# EAGLE design DotPhat (EAGLE 7.7.0)
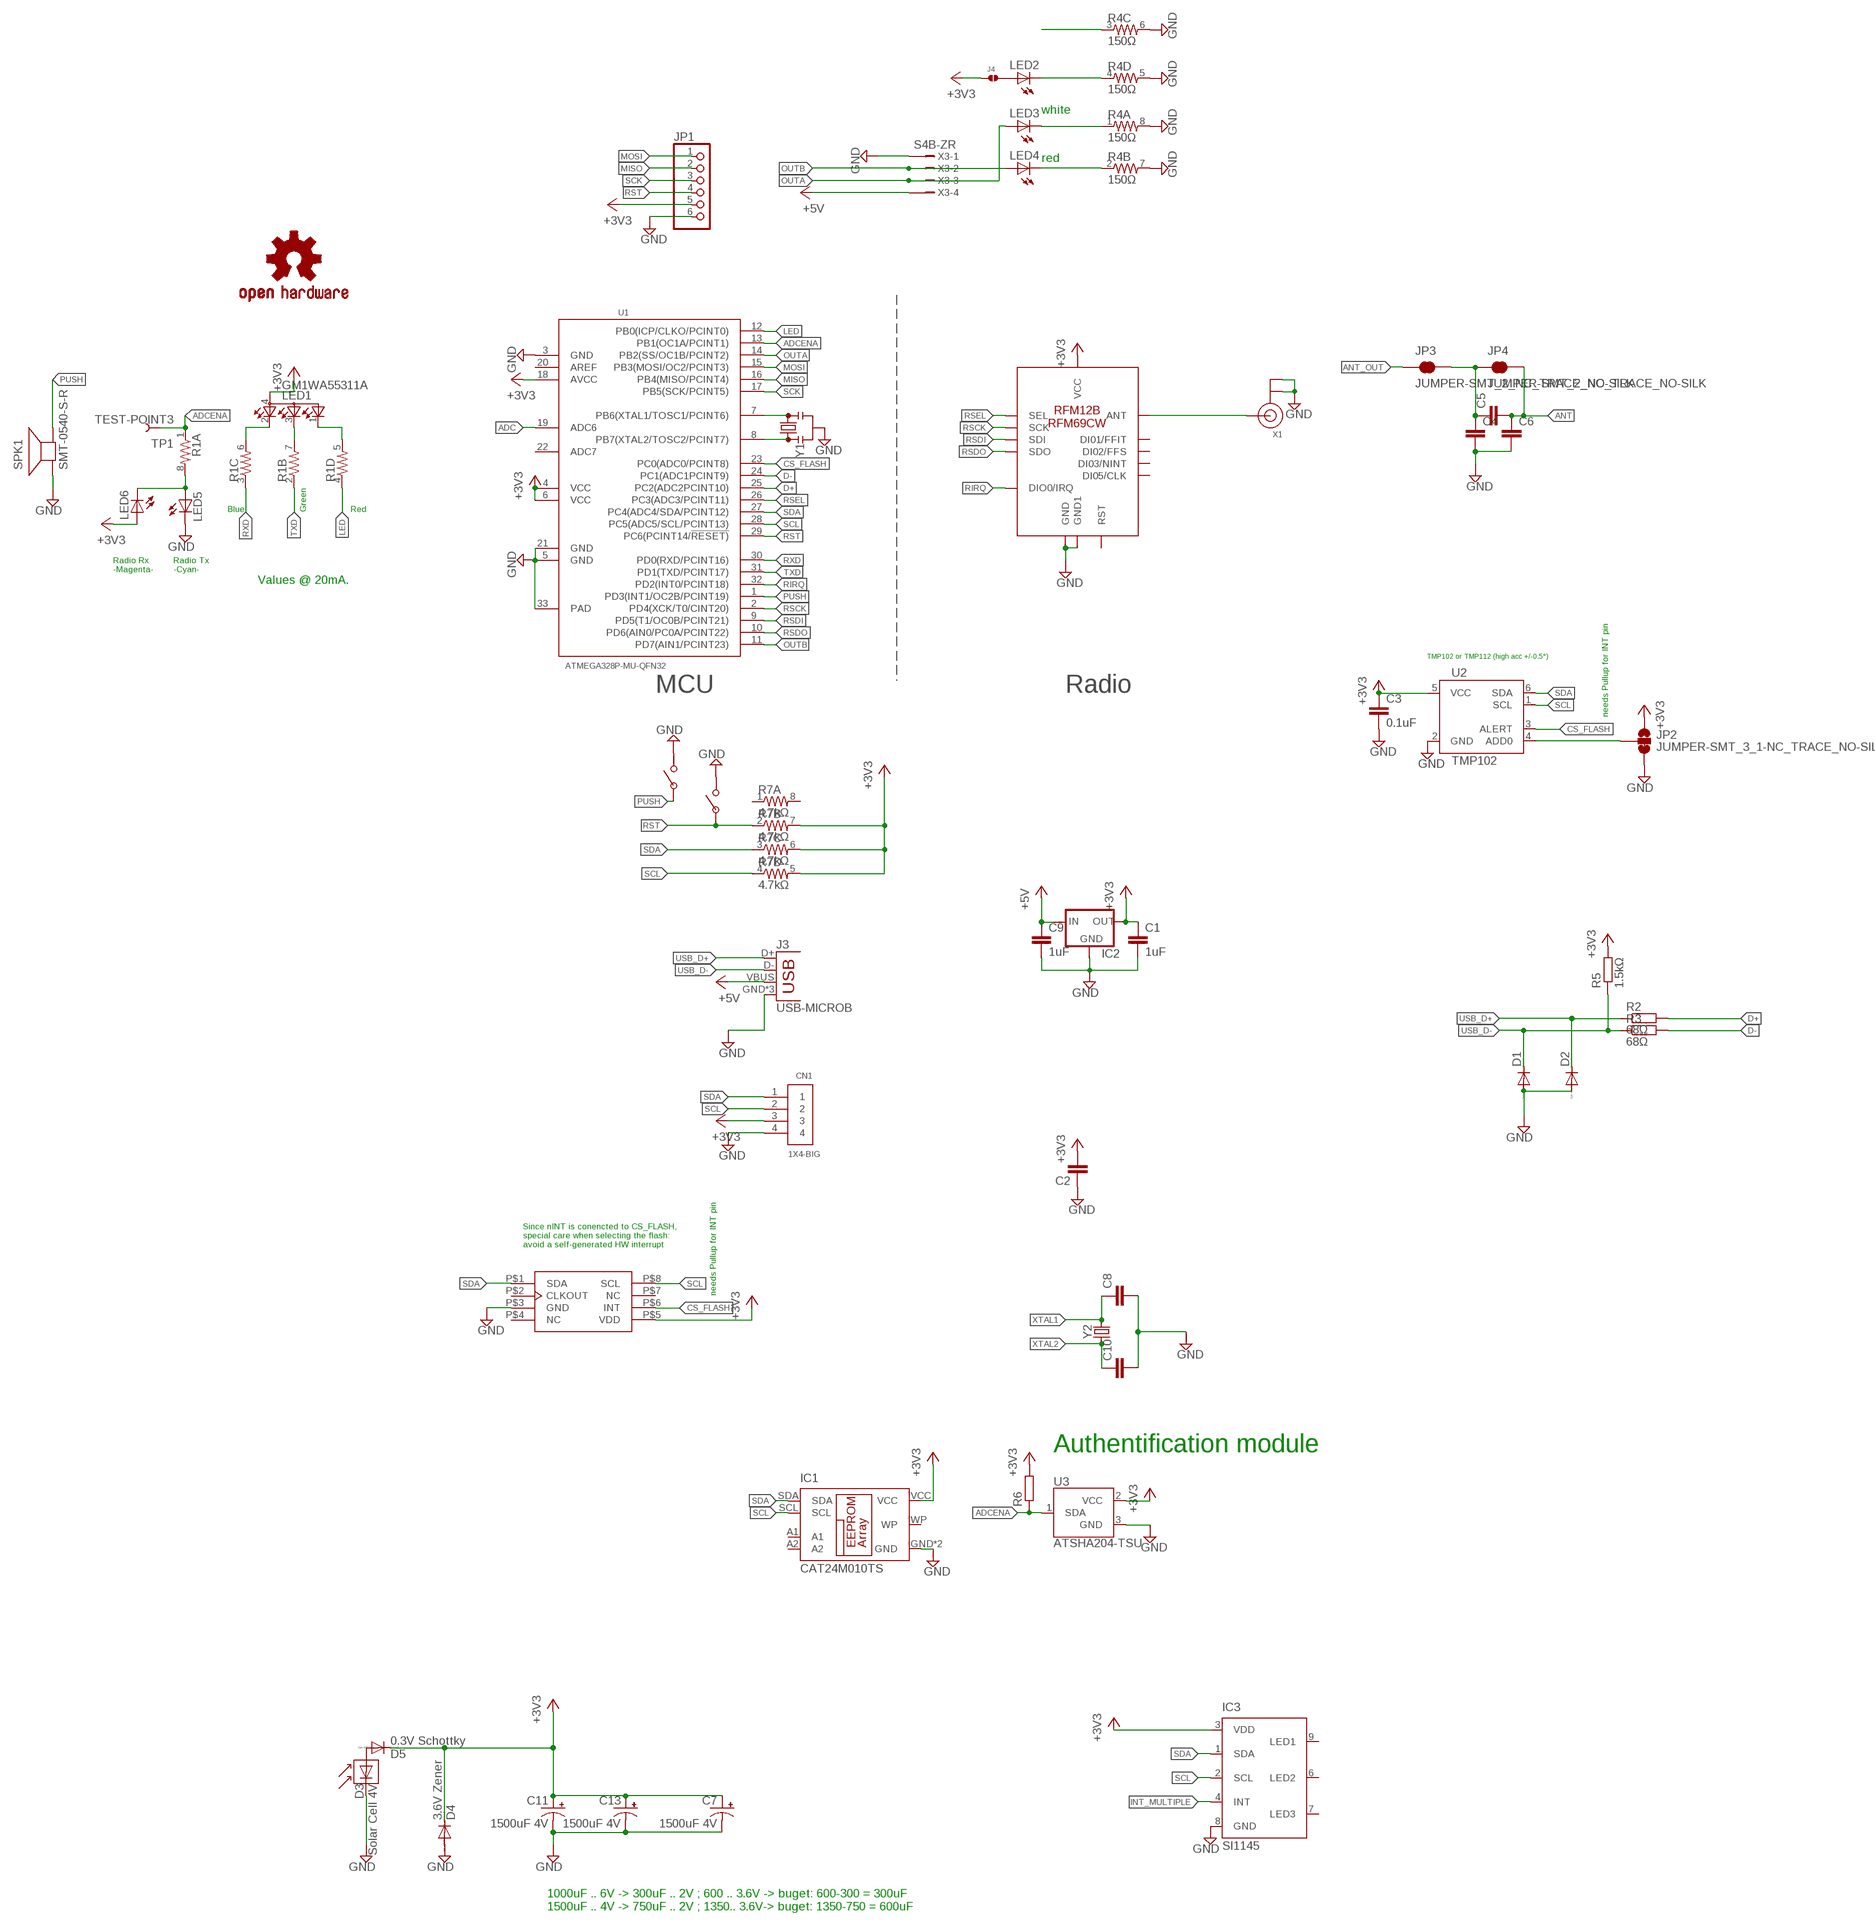
[diagram p0: schematic, sheet 1]

## Parts
C1  1uF  C-EUC0603  [C0603]
C2  C-EUC3216  [C3216]
C3  0.1uF  C-EUC0603  [C0603]
C4  C-EUC0603  [C0603]
C5  C-EUC0603  [C0603]
C6  C-EUC0603  [C0603]
C7  1500uF 4V  CPOL-USCT7343  [CT7343]
C8  C-EUC0402  [C0402]
C9  1uF  C-EUC0603  [C0603]
C10  C-EUC0402  [C0402]
C11  1500uF 4V  CPOL-USCT7343  [CT7343]
C13  1500uF 4V  CPOL-USCT7343  [CT7343]
CN1  1X4-BIG  [1X04-BIG]
D1  DIODE-SOD523  [SOD523]
D2  DIODE-SOD523  [SOD523]
D3  Solar Cell 4V  SOLAR-IXYS-  [SOLARBIT-12X1]
D4  3.6V Zener  DIODE-SOD523  [SOD523]
D5  0.3V Schottky  DIODE-SOD523  [SOD523]
IC1  CAT24M010TS  [TSSOP8]
IC2  MCP1700TT  [SOT-23]
IC3  SI1145  [QFN-10]
J3  USB-MICROB  [USB-MICROB]
J4  SOLDERJUMPER.2.MED  [2.MED]
JP1  PINHD-1X6  [1X06]
JP2  JUMPER-SMT_3_1-NC_TRACE_NO-SILK  [SMT-JUMPER_3_1-NC_TRACE_NO-SILK]
JP3  JUMPER-SMT_2_NC_TRACE_NO-SILK  [SMT-JUMPER_2_NC_TRACE_NO-SILK]
JP4  JUMPER-SMT_2_NC_TRACE_NO-SILK  [SMT-JUMPER_2_NC_TRACE_NO-SILK]
LED1  GM1WA55311A  [GM1WA55311A]
LED2  LED0603  [LED-0603]
LED3  LED0603  [LED-0603]
LED4  LED0603  [LED-0603]
LED5  LED0603  [LED-0603]
LED6  LED0603  [LED-0603]
LOGO1  OSHW-LOGOS  [OSHW-LOGO-S]
R1  RESISTOR-ARRAY0603-ARV  [0603-ARV]
R2  68Ω  R-EU_R0603  [R0603]
R3  68Ω  R-EU_R0603  [R0603]
R4  150Ω  RESISTOR-ARRAY0603-ARV  [0603-ARV]
R5  1.5kΩ  R-EU_R0603  [R0603]
R6  R-EU_R0603  [R0603]
R7  4.7kΩ  RESISTOR-ARRAY0603-ARV  [0603-ARV]
SPK1  SMT-0540-S-R  [SMT-0540-S-R]
TP1  TEST-POINT3  [PAD.03X.03]
U1  ATMEGA328P-MU-QFN32  MCU-ATMEGA328P-MU(QFN32)  [QFN32G-0.5-5X5MM]
U2  TMP102  [SOT563]
U3  ATSHA204-TSU  [SOT23-3]
U$1  RFM12B/69CW  [RFM12B/69CW]
U$2  PUSHBUTTON_4X2.5  [PUSHBUTTON_4X2.5]
U$3  PUSHBUTTON_4X2.5  [PUSHBUTTON_4X2.5]
X1  ANTENNA_U.FL  [U.FL]
X2  MC-RTC-RV-4162-C7-I2C  [MC-RTC-C7]
X3  S4B-ZR  [S4B-ZR]
Y1  RESONATORSMD-3.2X1.3  [RESONATOR-SMD-3.2X1.3]
Y2  CRYSTALSMD-3.2X1.5  [CRYSTAL-SMD-3.2X1.5MM]

## Nets
+3V3: C1.1 C2.2 C3.1 C7.+ C11.+ C13.+ CN1.3 D4.C D5.C IC1.VCC IC2.2(OUT) IC3.3(VDD) J4.1 JP1.5 JP2.1 LED1.4(A) LED6.A R5.2 R6.2 R7.5 R7.6 R7.7 U1.4(VCC) U1.6(VCC) U1.18(AVCC) U2.5(VCC) U3.2(VCC) U$1.VDD(VCC) X2.P$5(VDD)
+5V: C9.1 IC2.3(IN) J3.VBUS X3.4
ADC: U1.19(ADC6)
ADCENA: R1.1 R6.1 TP1.P$1 U1.13(PB1(OC1A/PCINT1)) U3.1(SDA)
ANT: C5.2 C6.1 JP4.2
ANT_OUT: JP3.1 U$1.ANT X1.3(SIGNAL)
CS_FLASH: U1.23(PC0(ADC0/PCINT8)) U2.3(ALERT) X2.P$6(INT)
D+: R2.2 U1.25(PC2(ADC2PCINT10))
D-: R3.2 U1.24(PC1(ADC1PCINT9))
GND: C1.2 C2.1 C3.2 C4.2 C6.2 C7.- C8.2 C9.2 C10.2 C11.- C13.- CN1.4 D1.A D2.A D3.-(C) D4.A IC1.GND IC1.NC(GND) IC2.1(GND) IC3.8(GND) J3.GND J3.MT1(GND) J3.MT2(GND) JP1.6 JP2.3 LED5.C R4.5 R4.6 R4.7 R4.8 SPK1.-(+) U1.3(GND) U1.5(GND) U1.21(GND) U1.33(PAD) U2.2(GND) U3.3(GND) U$1.GND U$1.GND1 U$2.P$2 U$3.P$2 X1.1(GND) X1.2(GND) X2.P$3(GND) X3.1 Y1.2
INT_MULTIPLE: IC3.4(INT)
LED: R1.4 U1.12(PB0(ICP/CLKO/PCINT0))
MISO: JP1.2 U1.16(PB4(MISO/PCINT4))
MOSI: JP1.1 U1.15(PB3(MOSI/OC2/PCINT3))
N$1: LED1.3(CBLUE) R1.7
N$2: LED3.C R4.1
N$3: C4.1 C5.1 JP3.2 JP4.1
N$4: LED1.2(CRED) R1.6
N$5: D3.+(A) D5.A
N$6: U1.7(PB6(XTAL1/TOSC1/PCINT6)) Y1.3
N$7: LED2.C R4.4
N$8: U1.8(PB7(XTAL2/TOSC2/PCINT7)) Y1.1
N$9: LED4.C R4.2
N$10: R4.3
N$11: JP2.2 U2.4(ADD0)
N$12: J4.2 LED2.A
N$13: LED5.A LED6.C R1.8
N$15: LED1.1(CGREEN) R1.5
OUTA: LED3.A U1.14(PB2(SS/OC1B/PCINT2)) X3.3
OUTB: LED4.A U1.11(PD7(AIN1/PCINT23)) X3.2
PUSH: SPK1.+(-) U1.1(PD3(INT1/OC2B/PCINT19)) U$3.P$1
RIRQ: U1.32(PD2(INT0/PCINT18)) U$1.IRQ(DIO0/IRQ)
RSCK: U1.2(PD4(XCK/T0/CINT20)) U$1.SCK
RSDI: U1.9(PD5(T1/OC0B/PCINT21)) U$1.SDI
RSDO: U1.10(PD6(AIN0/PC0A/PCINT22)) U$1.SDO
RSEL: U1.26(PC3(ADC3/PCINT11)) U$1.SEL
RST: JP1.4 R7.2 U1.29(PC6(PCINT14/!RESET)) U$2.P$1
RXD: R1.3 U1.30(PD0(RXD/PCINT16))
SCK: JP1.3 U1.17(PB5(SCK/PCINT5))
SCL: CN1.2 IC1.SCL IC3.2(SCL) R7.4 U1.28(PC5(ADC5/SCL/PCINT13)) U2.1(SCL) X2.P$8(SCL)
SDA: CN1.1 IC1.SDA IC3.1(SDA) R7.3 U1.27(PC4(ADC4/SDA/PCINT12)) U2.6(SDA) X2.P$1(SDA)
TXD: R1.2 U1.31(PD1(TXD/PCINT17))
USB_D+: D2.C J3.D+ R2.1
USB_D-: D1.C J3.D- R3.1 R5.1
XTAL1: C8.1 Y2.P$2
XTAL2: C10.1 Y2.P$1
Unconnected: IC1.A1 IC1.A2 IC1.WP IC3.6(LED2) IC3.7(LED3) IC3.9(LED1) R7.1 R7.8 U1.20(AREF) U1.22(ADC7) U$1.CLK(DI05/CLK) U$1.FFIT(DI01/FFIT) U$1.FFS(DI02/FFS) U$1.NINT(DI03/NINT) U$1.RST X2.P$2(CLKOUT) X2.P$4(NC) X2.P$7(NC)

## Notes on the sheet
- white
- red
- Blue | Green | Red
- Radio Rx
  -Magenta-
- Radio Tx
  -Cyan-
- Values @ 20mA.
- TMP102 or TMP112 (high acc +/-0.5°)
- MCU | Radio
- needs Pullup for INT pin
- Since nINT is conencted to CS_FLASH,
  special care when selecting the flash:
  avoid a self-generated HW interrupt
- needs Pullup for INT pin
- Authentification module
- 1000uF .. 6V -> 300uF .. 2V ; 600 .. 3.6V -> buget: 600-300 = 300uF
  1500uF .. 4V -> 750uF .. 2V ; 1350.. 3.6V-> buget: 1350-750 = 600uF

## Library data of the parts
C1 C2 C4-C6 C8-C10 = rcl:C-EU: CAPACITOR, European symbol
C3 = resistor:C-EU: CAPACITOR, European symbol
C7 C11 C13 = adafruit:CPOL-US: POLARIZED CAPACITOR, American symbol
CN1 = adafruit:1X4: 4-pin connector
D1 D2 D4 D5 = diode:DIODE-: DIODE
D3 = SparkFun:SOLAR-IXYS
IC1 = CAT24M01YI:CAT24M01: Serial EEPROM 1Mb, I2C; MF: On Semiconductor; MPN: 24C00T-E/ST
IC2 = MCP1700:MCP1700: Microchip MCP1700 positive regulator
IC3 = silabs:SI114*: PROXIMITY/UV/AMBIENT LIGHT SENSOR IC WITH I2C INTERFACE Source: http://www.silabs.com/Support%20Documents/TechnicalDocs/Si1145-46-47.pdf
J3 = SparkFun-Retired:USB: USB Connectors USB-B-PTH is fully proven SKU : PRT-00139/CONN-08278 USB-miniB is fully proven SKU : PRT-00587 USB-A-PCB is untested. USB-A-H is throughly reviewed, but untested. Spark Fun Electronics SKU : PRT-00437 USB-B-SMT is throughly reviewed, but untested. Needs silkscreen touching up. USB-A-S has not been used/tested USB-MB-H has not been used/tested USB-MICROB has been used. CONN-09505; PROD_ID: CONN-09505
J4 = solderjumper:SOLDERJUMPER.2
JP1 = adafruit:PINHD-1X6: PIN HEADER
JP2 = SparkFun-Jumpers:JUMPER-SMT_3_1-NC_TRACE: Normally closed trace jumper (1 of 2 connections) This jumper has a trace between two pads so it's normally closed (NC). The other connection is normally open (NO). Use a razor knife to open the connection. For best results follow the IPC guidelines for cutting traces: Cutout at least 0.063 mm (0.005 in). Remove all loose material to clean up the cut area. Seal the cut with an approved epoxy. Reapply solder to reclose the connection, or to close the NO connection.
JP3 JP4 = SparkFun-Jumpers:JUMPER-SMT_2_NC_TRACE: Normally closed trace jumper This jumper has a trace between two pads so it's normally closed (NC). Use a razor knife to open the connection. For best results follow the IPC guidelines for cutting traces: Cutout at least 0.063 mm (0.005 in). Remove all loose material to clean up the cut area. Seal the cut with an approved epoxy. Reapply solder to reclose the connection.
LED1 = led:GM1WA55311A: Chip LED RGB Source: http://document.sharpsma.com/files/GM1WA55311A_SS.pdf
LED2-LED6 = SparkFun:LED: LEDs Standard schematic elements and footprints for 5mm, 3mm, 1206, and 0603 sized LEDs. 5mm - Spark Fun Electronics SKU : COM-00529 (and others)
LOGO1 = Spark:OSHW-LOGO: Open Source Hardware Logo This logo indicates the piece of hardware it is found on incorporates a OSHW license and/or adheres to the definition of open source hardware found here: http://freedomdefined.org/OSHW
R1 R4 R7 = SparkFun:RESISTOR-ARRAY: Array Chip Resistor Source: RS Component / Phycomp
R2 R3 R5 R6 = rcl:R-EU_: RESISTOR, European symbol
SPK1 = adafruit:SMT-0540-S-R: SMT-0549-S-R Small surface-mount magnetic buzzer
TP1 = SparkFun:TEST-POINT
U1 = Seeed-OPL-ic:MCU-ATMEGA328P-MU(QFN32): 310010005; MPN: ATMEGA328P-MU
U2 = SparkFun:TMP102
U3 = SparkFun-IC-Special-Function:ATSHA204: Atmel ATSHA204 The Atmel ATSHA204 is an optimized authentication chip that includes a 4.5Kb EEPROM. This array can be used for storage of keys, miscellaneous read/write, read-only, password or secret data, and consumption tracking. Access to the various sections of memory can be restricted in a variety of ways and then the configuration locked to prevent changes. Datasheet <http://www.atmel.com/Images/Atmel-8740-CryptoAuth-ATSHA204-Datasheet.pdf> SparkFun Products SparkFun Electric Imp Shield <https://www.sparkfun.com/products/12887> SparkFun Electric Imp Breakout <https://www.sparkfun.com/products/12886>; PROD_ID: IC-11208
U$1 = rfm12b_withoutPlanes:RFM12B/69CW
U$2 U$3 = pusbbutton_4x2_5:PUSHBUTTON_4X2.5
X1 = adafruit:ANTENNA_U.FL: U.FL Antenna Connector
X2 = Microcrystal-RTC:MC-RTC-RV-4162-C7-I2C: Microcrystal RV-4162-C7 Real Time Clock Module with I2C Bus Ultra small SMT ceramic package with integrated 32.768kHz Crystal Automotive qualified, according to AEC-Q200 Rev. C I2C Interface Address: D0h Frequency-Offset Trimming Register Programmable Alarm and Interrupt Oscillator Fail Detection Watchdog Timer Programmable Clock-Output Time keeping mode down to 1.0 V
X3 = con-jst:?4B-ZR: ZH CONNECTOR 1.5 mm, 4 pin 1 row Source: http://www.jst.com .. eZH.pdf; MF: FARNELL; MPN: S4B-ZR(LF)(SN); OC_FARNELL: 9491830; OC_NEWARK: 38K8076
Y1 = SparkFun-Clocks:RESONATOR: Resonators (Generic) Ceramic resonators are clock-generating components, often used to control timing in microcontrollers. They usually have 3 pins: two pins for oscillation, and one pin for ground. Compared to crystals, resonators have worse tolerance, but are usually much cheaper. Plus, they have built-in load capacitors! These devices are used on boards like the Arduino Pro 8MHz <https://www.sparkfun.com/products/11114> and Arduino Pro 16MHz <https://www.sparkfun.com/products/11113>.
Y2 = SparkFun-Clocks:CRYSTAL: Crystals (Generic) These are passive quartz crystals, which can be used as a clock source for a microcontroller. Crystal's are two-terminal devices. They require external "load" capacitors to generate an oscillating signal.

## Board
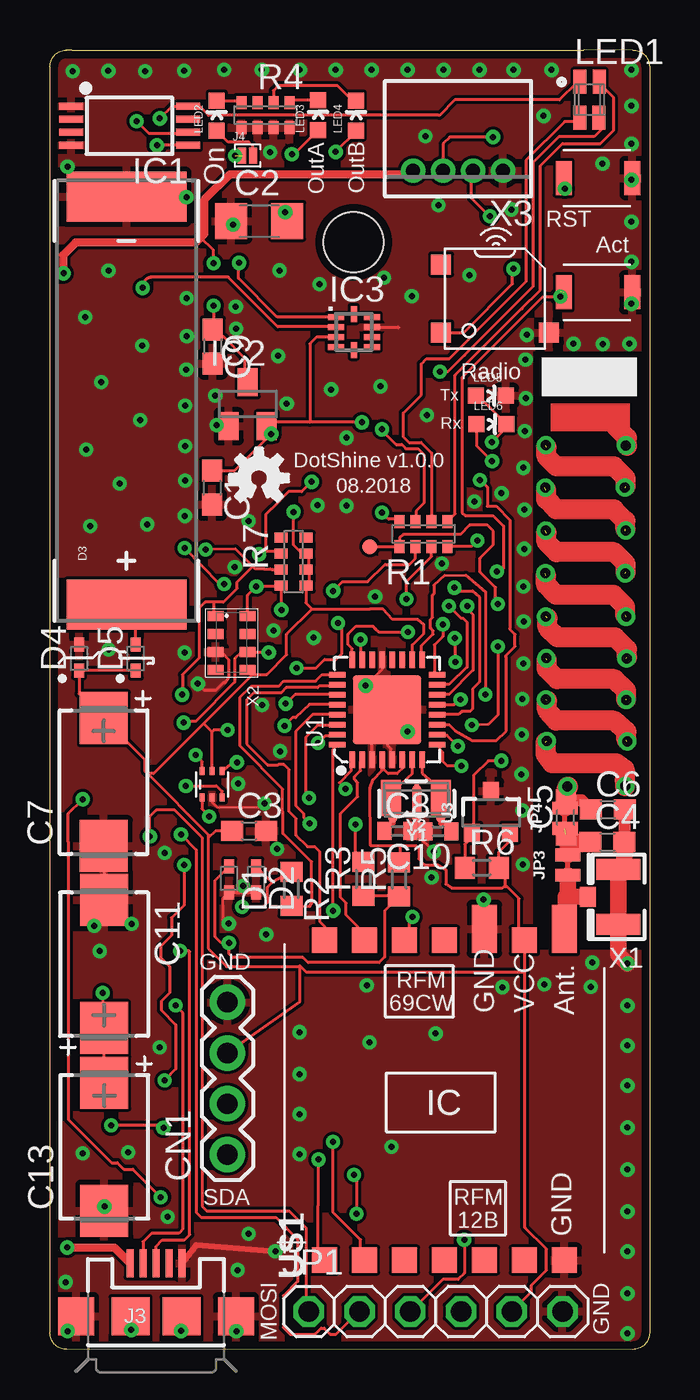
[diagram p1: board, top side]
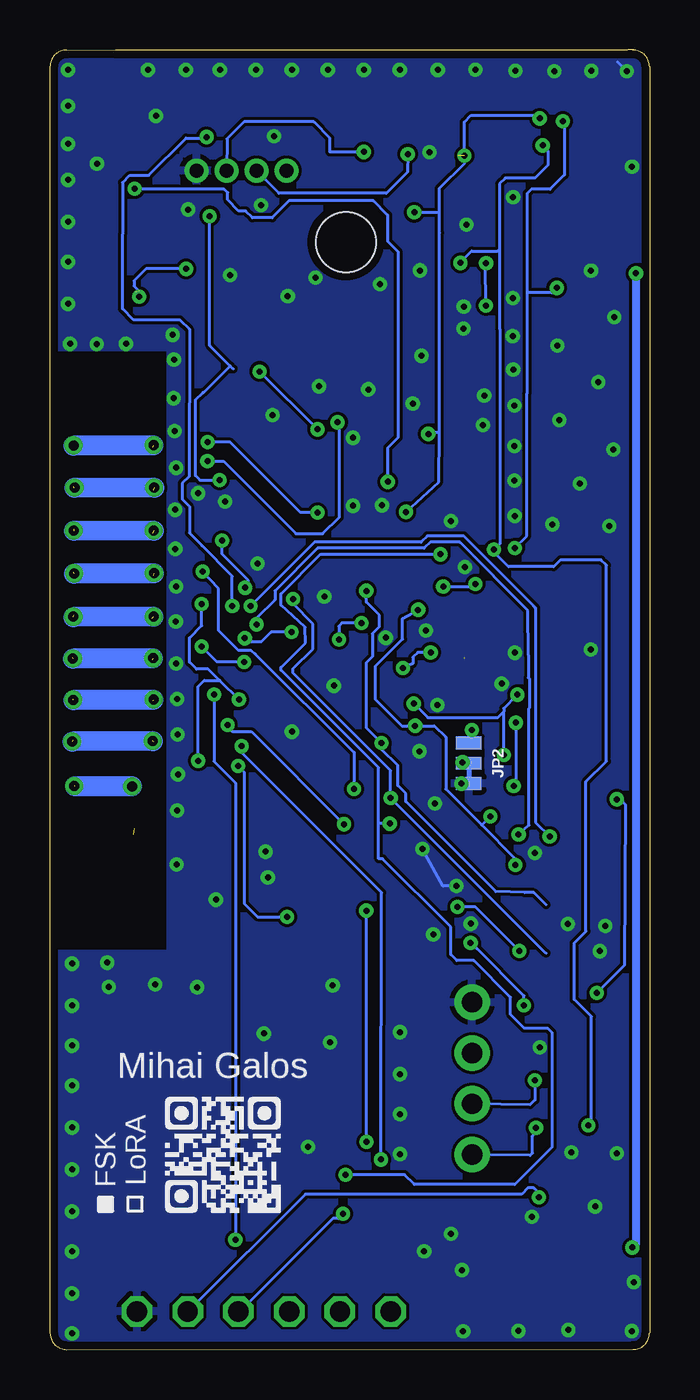
[diagram p2: board, bottom side, seen from below]

Size 30 x 65 mm. Coordinates in mm from the lower left corner, seen from the top.
Outline: 30,0.84 arc-90 29.17,0 0.84,0 arc-90 0,0.83 0,64.16 arc-90 0.83,65
Outline: 29.16,65 arc-90 30,64.17 30,0.84
Outline: 1.1,65 26.71,65
Outline: 0.8,65 1.1,65
Outline: 29.16,65 26.71,65
Outline: 29.17,65 29.16,65
Copper layers (1*16): Top 0.035mm / dielectric 1.5mm / Bottom 0.035mm
Design rules "Mihai_default *": minimum track width 6mil, minimum drill 0.3mm, track to track 6mil, track to pad 6mil, pad to pad 6mil, via to via 6mil, smd to smd 6mil, copper to edge 16mil, drill to drill 8mil, minimum pad ring 10mil, minimum via ring 8mil, stop-mask expansion 4mil, vias tented up to drill 0mil, thermal gap 10mil
Holes 3 mm at 15.2,55.39
tRestrict: area 24.2,20 to 30,49.9
bRestrict: area 24.2,20 to 30.1,49.9
vRestrict: area 14,28.7 to 19.8,34.9

### Footprints (pad centres in the part's own frame; a part is rotated, then mirrored left to right if it is on the bottom)
C0603 = smd 1.1 x 1: 1 -0.85,0; 2 0.85,0
C3216 = smd 1.6 x 1.8: 1 -1.4,0; 2 1.4,0
CT7343 = smd 2.6 x 2.4: + 3.2,0; - -3.2,0
C0402 = smd 0.7 x 0.9: 1 -0.65,0; 2 0.65,0
1X04-BIG = drill 1.016 pad 1.778: 1 0,0; 2 2.54,0; 3 5.08,0; 4 7.62,0
SOD523 = smd 0.7 x 0.5: A 0.7,0; C -0.6,0
SOLARBIT-12X1 = smd 2.5 x 6: + -10.2,0; - 10.2,0
TSSOP8 = smd 1.2 x 0.35: A1 -2.925,1.595; A2 -2.925,0.945; GND -2.925,0.295; NC -2.925,2.245; SCL 2.925,0.945; SDA 2.925,0.295; VCC 2.925,2.245; WP 2.925,1.595
SOT-23 = smd 1 x 1.4: 1 -0.95,-1.1; 2 0.95,-1.1; 3 0,1.1
QFN-10 = smd 0.8 x 0.3: 1 -0.9,0.75; 2 -0.9,0.25; 3 -0.9,-0.25; 4 -0.9,-0.75; 6 0.9,-0.75; 7 0.9,-0.25; 8 0.9,0.25; 9 0.9,0.75 | smd 0.3 x 0.8: 5 0,-0.9; 10 0,0.9
USB-MICROB = smd 0.35 x 1.4: D+ 0,2.65; D- -0.65,2.65; GND 1.3,2.65; ID 0.65,2.65; VBUS -1.3,2.65 | smd 1.8 x 1.9: MT1 -4,0; MT2 4,0 | smd 1.9 x 1.9: P$1 -1.27,0; P$2 1.27,0
2.MED = smd 0.406 x 0.813: 1 -0.279,0; 2 0.279,0
1X06 = drill 1.016 octagon: 1 -6.35,0; 2 -3.81,0; 3 -1.27,0; 4 1.27,0; 5 3.81,0; 6 6.35,0
SMT-JUMPER_3_1-NC_TRACE_NO-SILK = smd 0.635 x 1.27: 1 -1.016,0; 2 0,0; 3 1.016,0
SMT-JUMPER_2_NC_TRACE_NO-SILK = smd 0.635 x 1.27: 1 -0.508,0; 2 0.508,0
GM1WA55311A = smd 0.65 x 1.2: 1 0.477,0.9; 2 -0.475,-0.9; 3 0.475,-0.9; 4 -0.477,0.9
LED-0603 = smd 0.8 x 0.8: A 0,-0.75; C 0,0.75
0603-ARV = smd 0.5 x 0.65: 1 -1.2,-0.625; 2 -0.4,-0.625; 3 0.4,-0.625; 4 1.2,-0.625; 5 1.2,0.625; 6 0.4,0.625; 7 -0.4,0.625; 8 -1.2,0.625
R0603 = smd 1 x 1.1: 1 -0.85,0; 2 0.85,0
SMT-0540-S-R = smd 1 x 1: + 1.7,-2.7; - 1.7,2.7; M -1.7,-2.7
PAD.03X.03 = smd 0.762 x 0.762: P$1 0,0
QFN32G-0.5-5X5MM = smd 0.813 x 0.279: 1 -2.5,1.75; 2 -2.5,1.25; 3 -2.5,0.75; 4 -2.5,0.25; 5 -2.5,-0.25; 6 -2.5,-0.75; 7 -2.5,-1.25; 8 -2.5,-1.75; 17 2.5,-1.75; 18 2.5,-1.25; 19 2.5,-0.75; 20 2.5,-0.25; 21 2.5,0.25; 22 2.5,0.75; 23 2.5,1.25; 24 2.5,1.75 | smd 0.279 x 0.813: 9 -1.75,-2.5; 10 -1.25,-2.5; 11 -0.75,-2.5; 12 -0.25,-2.5; 13 0.25,-2.5; 14 0.75,-2.5; 15 1.25,-2.5; 16 1.75,-2.5; 25 1.75,2.5; 26 1.25,2.5; 27 0.75,2.5; 28 0.25,2.5; 29 -0.25,2.5; 30 -0.75,2.5; 31 -1.25,2.5; 32 -1.75,2.5 | smd 3.429 x 3.429: 33 0,0
SOT563 = smd 0.25 x 0.4: 1 -0.5,-0.66; 2 0,-0.66; 3 0.5,-0.66; 4 0.5,0.66; 5 0,0.66; 6 -0.5,0.67
SOT23-3 = smd 0.8 x 0.9: 1 -0.95,-1; 2 0.95,-1; 3 0,1.1
RFM12B/69CW = smd 2.413 x 1.27: ANT 9.06,-6; GND 9.06,-2 | smd 1.27 x 1.27: CLK -7.5,-2; FFIT -7.5,0; FFS -7.5,2; GND1 -7.5,-6; IRQ -7.5,4; NINT 8.5,0; RST -7.5,-4; SCK 8.5,4; SDI 8.5,2; SDO -7.5,6; SEL 8.5,6; VDD 8.5,-4
PUSHBUTTON_4X2.5 = smd 0.8 x 1.7: P$1 -1.27,0; P$2 2.159,0
U.FL = smd 2.2 x 1.05: 1 0,1.375; 2 0,-1.375 | smd 0.8 x 1: 3 1.525,0
MC-RTC-C7 = smd 0.5 x 0.8: P$1 -1.35,-0.8; P$2 -0.45,-0.8; P$3 0.45,-0.8; P$4 1.35,-0.8; P$5 1.35,0.8; P$6 0.45,0.8; P$7 -0.45,0.8; P$8 -1.35,0.8
S4B-ZR = drill 0.7 pad 1.1: 1 -2.25,0; 2 -0.75,0; 3 0.75,0; 4 2.25,0
RESONATOR-SMD-3.2X1.3 = smd 0.45 x 1.905: 1 -1.2,0; 2 0,0; 3 1.2,0
CRYSTAL-SMD-3.2X1.5MM = smd 1 x 1.8: P$1 -1.25,0; P$2 1.25,0

### Placement (x,y rotation side)
C1  8.1,43.11 270 top
C2  10.47,56.45 0 top
C3  9.96,25.94 0 top
C4  27.89,25.38 0 top
C5  25.81,26.62 90 top
C6  27.91,27 0 top
C7  2.69,28.38 90 top
C8  17.38,25.93 0 top
C9  8.14,50.17 270 top
C10  19.43,25.92 180 top
C11  2.71,19.28 270 top
C13  2.73,10.14 90 top
CN1  8.88,9.75 90 top
D1  8.96,23.57 270 top
D2  10.32,23.57 270 top
D3  3.84,47.45 90 top
D4  1.46,34.57 90 top
D5  4.3,34.56 90 top
IC1  3.98,59.94 0 top
IC2  9.9,47.29 0 top
IC3  15.2,50.89 0 top
J3  5.31,1.66 0 top
J4  9.88,59.71 0 top
JP1  19.3,1.9 0 top
JP2  9.04,29.33 270 bottom
JP3  25.91,24.23 90 top
JP4  25.77,26.57 90 top
LED1  27,62.5 0 top
LED2  8.34,61.72 0 top
LED3  13.42,61.74 0 top
LED4  15.31,61.73 0 top
LED5  22.07,47.71 270 top
LED6  22.09,46.29 270 top
LOGO1  10.46,43.59 0 top
R1  18.69,40.8 0 top
R2  12.08,23.04 270 top
R3  15.68,23.54 90 top
R4  10.78,61.75 180 top
R5  17.47,23.51 90 top
R6  21.61,24.1 0 top
R7  12.2,39.4 270 top
SPK1  22.27,52.57 270 top
TP1  16.01,40.16 0 top
U1  16.87,32 90 top
U2  8.12,28.27 0 top
U3  22.08,26.84 0 top
U$1  19.74,11.97 90 top
U$2  26.98,58.6 0 top
U$3  26.98,52.88 0 top
X1  28.44,22.64 180 top
X2  9.09,35.33 270 top
X3  20.42,58.96 180 top
Y1  18.35,27.31 180 top
Y2  18.32,27.6 180 top

### Tracks (layer width: path | path; a pad name or v marks a point on that pad's centre or on a via)
+3V3  (via drill 0.3)  (1 unrouted)
  Top 0.152: U1.6 17.68,29.42 17.68,29.11 17.37,28.81 16.92,28.81 16.61,29.11 16.61,29.42 U1.4 16.61,29.49 16.61,28.95 16.15,28.5 16.02,28.05 16.03,25.22 16.65,25.21 17.54,25.21 | 23.77,18.9 23.77,6.1 24.84,5.03 24.84,3.96 24.08,3.2 24.08,2.9 23.16,1.98 JP1.5 | 23.77,18.9 23.77,20.42 U$1.VDD 23.62,20.58 23.47,20.73 23.47,22.56 22.86,23.17 22.72,23.17 | LED1.4 26.52,63.55 26.36,63.71 26.36,63.37 25.5,62.5 20.26,62.5 19.48,61.72 19.47,61.73 7.93,61.73 7.48,62.19 IC1.VCC 6.11,62.19 v5.5,61.58 | 13.11,37.04 16,37.04 16,37.03 16.67,37.03 17.14,36.52 18.41,36.52 18.7,36.27 18.7,35.81 18.14,35.24 18.14,34.6 U1.18 | 13.11,37.04 12.8,37.34 12.8,38.1 R7.5 12.95,38.25 12.95,38.86 R7.6 12.95,39.02 12.95,39.78 R7.7 12.8,39.93 12.5,39.93 12.19,40.24 v12.2,41.9 | 4.88,28.81 5.18,28.81 7.7,31.32 | 10.14,33.77 7.7,31.32 | 23.77,18.9 12.8,18.9 12.51,19.19 | 7.92,25.58 7.92,25.76 4.88,28.81 | CN1.3 12.51,17.39 12.51,19.19 | U2.5 8.12,30.9 | 8.12,30.9 7.7,31.32 | C3.1 8.29,25.94 7.92,25.58 | v8.88,30.99 8.21,30.99 8.12,30.9 | 17.54,25.21 18.32,25.21 18.45,25.07 18.45,24.54 18.75,24.25 19.41,24.25 19.8,24.01 19.8,23.28 20.09,23.1 22.64,23.09 22.72,23.17 | 7.92,25.58 7.92,20.07 8.83,19.16 12.47,19.16 12.51,19.19 | U3.2 23.13,25.55 22.46,24.88 R6.2 22.79,23.76 22.79,23.24 22.72,23.17 | C2.2 11.87,56.75 v11.78,56.88 | R5.2 arc90 17.54,24.43 17.54,25.21 | X2.P$5 9.93,33.98 10.14,33.77 | 10.14,33.77 10.86,33.77 11.85,34.76 11.85,35.78 13.11,37.04 | C1.1 9.23,43.96 v11.07,45.8 10.85,46.02 IC2.2 11.04,46.38 13.01,46.38 | J4.1 | v15.61,46.38 13.01,46.38 | LED6.A 21.34,45.21 v22.12,44.43 | 4.88,28.81 4.77,28.91 4.77,29.49 C7.+ 1.46,32.81 D4.C
  Top 0.152: IC3.3 13.34,50.63 13.01,50.31 13.01,46.38 | v5.54,7.62 4.15,9.02 3.69,9.02 3.37,9.34 3.08,9.34 0.91,11.51 0.92,25.4 0.92,26.8 v1.64,27.52 | D5.C D4.C | D4.C | v2.63,17.84 2.63,17.32 C11.+ 2.67,13.62 C13.+
  Bottom 0.152: JP1.5 23.01,1.98 17.22,7.77 6.4,7.77 6.1,8.08 5.79,8.08 5.54,7.83 v5.54,7.62 | v12.2,41.9 10.54,43.39 10.52,45.9 | 10.52,45.9 10.52,55.86 | 10.52,55.86 10.52,57.83 | 10.52,57.83 10.52,58.09 9.25,59.34 9.24,59.69 v9.27,59.72 9.27,61.4 8.94,61.73 5.65,61.73 v5.5,61.58 | v11.07,45.8 11.02,45.8 11.02,45.9 10.52,45.9 | JP2.1 9.04,30.83 v8.88,30.99 | 10.51,55.85 10.52,55.86 | v11.78,56.88 10.53,56.88 10.52,57.83 | v22.12,44.43 21.32,44.43 17.7,40.81 16.36,40.81 15.53,41.64 15.53,46.3 v15.61,46.38 | v1.64,27.52 1.48,27.52 1.21,27.26 1.26,19.22 v2.63,17.84
+5V  (via drill 0.3)
  Top 0.152: v8.19,52.22 8.2,50.61 8.14,50.61 C9.1 8.51,50.65 8.69,50.65 9.78,49.56 9.78,48.51 | 9.77,48.52 9.78,48.51 | 9.78,48.51 IC2.3 | v8.18,54.33 8.18,54.99 7.54,55.62
  Top 0.305: 17.56,58.78 18.15,59.37 X3.4 | 3.98,4.34 J3.VBUS | J3.VBUS 4.01,4.56 | J3.VBUS arc-90 J3.VBUS
  Top 0.406: 17.56,58.78 8.99,58.78 7.72,57.51 7.72,55.8 7.54,55.62 7.29,55.37 1.28,55.37 0.66,54.75 0.66,53.85 v0.68,53.83 | v0.87,5.1 3.22,5.1 J3.VBUS
  Bottom 0.152: v8.19,52.22 8.2,54.31 v8.18,54.33
  Bottom 0.406: v0.68,53.83 0.68,5.29 v0.87,5.1
ADCENA  (via drill 0.3)
  Top 0.152: U1.13 20.22,32.25 v20.55,32.51 | U3.1 21.21,25.72 | 21.21,25.72 21.21,28.73 21.93,29.45 v22.58,29.45 | 21.21,25.72 20.76,25.27 R6.1 | v22.41,37.3 22.3,37.4 22.3,38.12 21.52,38.9 21.52,39.59 22.18,40.25 22.18,40.94 21.89,41.23 21,41.23 20.54,40.77 17.66,40.77 17.49,40.6 R1.1 17.49,40.16 TP1.P$1
  Bottom 0.152: 20.61,32.51 v20.55,32.51 21.51,33.47 | v22.58,29.45 22.58,33.18 22.29,33.47 21.51,33.47 | 21.51,33.47 22.08,34.03 22.67,34.03 23.02,34.38 23.02,35.6 22.41,36.21 v22.41,37.3
ANT  (via drill 0.3)  (16 unrouted)
  Top 0.61: C6.1 26.59,27.47 C5.2 25.8,28.09 v25.89,28.17
  Top 0.813: JP4.2 25.77,28.05 v25.89,28.17
  Top 1: 24.8,30.38 24.8,29.77 25.12,29.33 28.33,29.33 28.76,29.02 28.76,28.46 28.77,28.18 | 28.84,30.49 28.84,30.91 28.22,31.46 25.34,31.46 24.88,32 24.88,32.45 24.87,32.46 | 28.83,32.54 28.83,32.95 28.25,33.53 25.37,33.53 24.86,34.04 24.86,34.5 24.85,34.51 | 28.86,34.62 28.86,35.03 28.28,35.61 25.4,35.61 24.89,36.12 24.89,36.58 24.89,36.59 | 28.79,36.75 28.79,37.16 28.2,37.74 25.32,37.74 24.82,38.25 24.82,38.71 24.81,38.72 | 28.81,38.89 28.81,39.3 28.23,39.88 25.35,39.88 24.84,40.39 24.84,40.85 24.83,40.86 | 28.8,41.03 28.8,41.44 28.22,42.02 25.34,42.02 24.83,42.53 24.83,42.99 24.82,43 | 28.81,43.17 28.81,43.59 28.23,44.17 25.35,44.17 24.84,44.68 24.84,45.13 24.83,45.14
  Bottom 1: 24.86,30.43 28.87,30.41 | 24.82,32.5 28.83,32.49 | 24.84,34.57 28.85,34.56 | 24.82,36.65 28.83,36.64 | 24.79,38.82 28.8,38.81 | 24.79,40.96 28.8,40.95 | 24.77,43.11 28.78,43.1 | 24.82,45.22 28.83,45.21 | v25.89,28.17 28.75,28.17
ANT2
  Top 1: 28.87,45.2 28.87,45.61 28.29,46.19
ANT_OUT
  Top 0.813: X1.3 25.82,22.66 | 25.82,22.66 25.82,21.11 U$1.ANT | JP3.1 25.91,22.76 25.82,22.66
CS_FLASH  (via drill 0.3)  (1 unrouted)
  Top 0.152: v15.54,35.51 15.54,34.6 U1.23 | v10.95,34.87 v10.94,34.88 X2.P$6 9.58,34.88 9.27,34.58 | 12.07,34.1 v12.33,34.1 13.32,34.1 13.74,34.52 14.31,34.52 14.61,34.81 14.61,36.16 v14.42,36.34 | U2.3 8.62,27.92 8.34,28.2 v6.8,28.2 | 9.25,34.57 9.25,33.38 7.29,31.42 6.75,31.42 v6.68,31.35
  Bottom 0.152: v10.95,34.87 11.6,34.87 11.84,34.64 11.84,34.31 v12.33,34.1 | v14.42,36.34 15.39,36.34 15.54,36.19 v15.54,35.51 | v6.68,31.35 6.68,28.31 v6.8,28.2
D+
  Top 0.152: R2.2 12.99,22.17 13.12,22.37 13.1,24.39 11.66,25.81 11.64,28.03 9.49,30.21 9.49,32.6 10.06,33.18 11.44,33.18 11.69,33.43 13.29,33.43 13.62,33.75 U1.25
D-  (via drill 0.3)
  Top 0.152: 20.89,31.25 v21.12,31.25 21.93,31.26 22.42,31.75 v22.42,35.16 | v17.91,35.88 v17.9,35.89 16.45,35.89 16.3,36.04 | v20.25,35.58 20.25,34.41 v20.28,34.39 | v15.29,26.27 15.29,24.79 arc90 15.63,24.45 15.68,24.4 R3.2 | 16.3,36.04 16.3,36.05 | U1.24 15.12,35.06 14.92,35.26 14.92,35.78 15.32,36.18 16.16,36.18 16.3,36.04
  Bottom 0.152: v21.12,31.25 20.89,30.95 20.85,30.9 19.92,30.9 v15.29,26.27 | v17.91,35.88 18.94,35.88 19.43,35.39 20.07,35.39 v20.25,35.58 | v20.28,34.39 21.65,34.4 v22.42,35.16
GND  (via drill 0.3)
  Top 0.152: 16.92,30.9 16.92,30.18 17.07,30.03 17.07,29.57 U1.5 | 16.92,30.9 16.92,31 | 16.92,31 16.92,31.85 U1.33 15.8,33.07 v15.8,33.2 16.62,34.02 U1.21 | U1.3 16.12,30.92 16.2,31 16.92,31 | v17.9,30.9 16.92,30.9 | D1.A D2.A | D1.A 9.35,22.87 v9.66,23.18 | v8.95,21.3 8.67,21.3 8.67,22.58 D1.A | 18.35,26.29 18.34,25.77 | 18.34,25.77 v19.21,24.9 | C10.2 18.77,25.89 C8.2 18.14,25.77 18.34,25.77 | U2.2 8.12,27.35 8.37,27.13 10.51,27.12 v10.75,27.32 | 23.48,45.92 23.71,45.92 | X2.P$3 8.58,34.88 8.93,34.52 8.93,33.59 8.79,33.36 8.69,33.36 8.3,32.97 7.73,32.97 v7.4,33.3 | IC3.8 17.44,51.14 17.44,51.09 | C7.- 2.71,25.18 C11.-
  Top 0.305: J3.GND 7.33,5.23 v11.28,4.9
  Top 0.61: C6.2 28.75,26.99 C4.2 28.76,25.4
  Top 0.813: 28.76,25.4 28.73,24.06 X1.2 X1.1 28.44,19.76 v28.9,19.3
  Bottom 0.152: JP2.3 v9.42,28.31 v9.42,28.3 | v9.66,23.18 10.33,23.18 v11.37,25.03 | v1.13,63.93 1.6,64.4
  other vias: 13.2,35.6 11.2,35.97 9.93,41.44 24.74,18.26 22.63,18.12 21.7,22.5 19.3,15.8 28.9,17.2 28.9,15.2 28.9,13.2 28.9,11.1 28.9,9 28.9,6.9 28.9,4.9 28.9,2.8 28.9,0.8 23.67,24.26 23.64,26.97 23.6,28.78 23.61,30.76 23.65,32.54 23.68,34.31 23.7,36.41 23.69,38.16 23.73,40.05 23.75,42 23.68,44.1 23.8,49.52 23.86,50.75 29.1,62.2 29.1,60.3 29.1,58.5 29.1,56.4 29,50.3 26.2,50.3 29.1,52.3 29.1,64 29.1,54.4 27.07,18.14 15.85,18.21 10.6,64 12.5,64 14.3,64 16.1,64 17.9,64 19.7,64 21.5,64 23.2,64 25.1,64 24.7,61.7 9.3,52.16 11.52,29.93 10.82,20.77 19.1,23.6 9.33,0.92 0.89,0.92 27.15,19.35 27.65,59.31 23.08,57.03 20.99,53.73 19.44,57.24 8.71,64.01 6.71,63.96 6.75,41.7 6.76,43.47 6.76,45.19 6.76,47.21 12.49,15.87 12.49,13.77 12.49,11.77 12.49,9.77 9.31,51.06 6.84,52.59 6.83,57.64 18.86,46.74 21.24,42.42 9.25,39.14 16.27,37.66 14.85,42.2 10.61,32.24 11.01,59.9 4.07,0.98 6.56,0.93 0.78,3.38 15.99,15.37 9.16,56.27 0.88,59.16 9.39,3.97 6.85,50.69 6.82,49.01 14.83,45.6 27.67,50.29 18.8,60.69 17.08,10.14 9.93,5.79 8.28,47.71 8.34,46.24 23.82,47.58 23.76,45.93 22.6,42.83 19.62,39.31 11.85,47.31 13.38,42.23 5.89,6.63 6.73,34.85 2.94,35.02 4.76,63.95 2.92,63.96 2.22,21.2 2.49,19.93 4.09,21.29 5.49,15.11 5.74,24.83 2.73,7.15 1.63,9.81 3.92,9.87 2.93,53.96 4.61,50.22 4.86,41.27 1.81,45.01 4.5,46.49 2.01,41.2 1.76,51.65 2.57,48.39 3.49,43.31 18.1,52.68 16.54,48.18 16.71,53.62 11.42,49.7 11.48,53.98 14.07,48.03 13.5,53.29
  pour Top: 0,-0.1 29.9,-0.1 29.9,65 0,65
  pour Bottom: 0,0 29.9,0 29.9,65 0,65
LED  (via drill 0.3)
  Top 0.152: v20.23,38.1 20.38,37.95 21.14,37.95 21.49,37.65 21.49,33.38 21.14,33.03 21.14,32.05 21.02,31.92 20.6,31.92 20.42,31.77 19.44,31.77 U1.12 | v21.39,40.46 21.09,40.17 R1.4
  Bottom 0.152: v20.23,38.1 20.07,38.46 21.39,39.78 v21.39,40.46
MISO  (via drill 0.3)
  Top 0.152: 19.51,33.84 U1.16 19.23,33.89 19.23,35.25 19.66,35.67 v19.66,36.27 | v6.55,25.76 7.32,25 7.32,6.86 7.57,6.61 11.3,6.61 12.39,5.51 12.39,3.41 11.68,2.69 11.68,1.09 12.01,0.76 13.26,0.76 13.56,1.07 13.72,1.07 14.02,0.76 14.33,0.76 15.39,1.83 JP1.2
  Bottom 0.152: v19.66,36.27 19.66,36.58 18.75,37.49 18.75,37.95 16.61,40.08 11.28,40.08 10.97,40.39 9.5,40.39 6.1,36.96 6.07,34.75 6.07,33.61 6.03,33.56 6.03,32.08 6.03,32.07 6.03,26.23 v6.55,25.76
MOSI  (via drill 0.3)
  Top 0.152: v19.96,37.19 20.57,36.58 20.67,36.58 20.87,36.38 20.87,34.13 19.95,33.27 19.34,33.27 U1.15 | 12.8,1.96 12.8,1.98 | 12.8,1.98 JP1.1 | 12.8,1.98 12.8,6.1 11.96,6.94 7.85,6.94 7.62,7.17 7.62,25.61 6.25,26.98 5.32,26.98 5,26.66 v5,25.67
  Bottom 0.152: v19.96,37.19 16.76,40.39 11.43,40.39 11.12,40.69 9.3,40.69 5.79,37.19 5.79,37.18 5.7,37.09 5.7,26.37 v5,25.67
N$1  (via drill 0.3)
  Top 0.152: LED1.3 27.58,61.57 27.58,61.02 27.23,60.67 25.47,60.67 24.16,59.36 24.16,53.17 20.73,49.74 | v16.61,46.03 16.61,45.98 17.32,45.27 17.6,45.27 17.8,45.06 18.41,45.06 18.72,44.76 18.72,42.34 18.31,41.94 18.31,41.44 R1.7 | v19.51,48.92 19.92,48.92 20.73,49.74 | 20.73,49.74 20.74,49.74
  Bottom 0.152: v19.51,48.92 v16.61,46.03
N$2
  Top 0.152: LED3.C 12.08,62.48 R4.1
N$3  (1 unrouted)
  Top 0.813: JP3.2 25.91,25.29 | 25.91,25.29 25.91,25.66 C5.1 | C4.1 26,25.38 25.91,25.29
N$4
  Top 0.152: LED1.2 26.52,61.57 26.36,61.42 25.76,61.42 23.82,59.48 23.82,53.42 21.07,50.67 21.07,50.65 21.07,50.64 19.98,49.56 18.84,49.56 18.58,49.3 18.58,47.75 17.68,46.85 17.68,45.65 17.96,45.37 18.57,45.37 19.09,44.84 R1.6 19.09,41.72
N$5
  Top 0.152: D5.A 4.3,36.79 D3.+
N$6
  Top 0.152: U1.7 18.14,29.42 18.14,28.81 17.33,28.1 17.17,28 17.07,27.54 Y1.3
N$7
  Top 0.152: LED2.C 9.48,62.47 R4.4
N$8
  Top 0.152: U1.8 18.64,28.82 19.51,28.05 19.51,27.35 19.56,26.7 19.46,27.39 Y1.1
N$9
  Top 0.152: LED4.C 15.19,62.44 15.15,62.44 14.39,63.2 11.4,63.2 11.18,62.98 R4.2
N$11  (via drill 0.3)
  Top 0.152: v9.35,29.37 9.14,29.37 U2.4
  Bottom 0.152: v9.35,29.37 9.13,29.28 JP2.2
N$12
  Top 0.152: J4.2 10.16,60.18 9.95,60.39 8.92,60.39 LED2.A
N$13  (via drill 0.3)
  Top 0.152: R1.8 17.38,41.53 16.94,41.53 v16.61,41.86 | LED5.A 21.41,47.71 22.46,46.66 22.48,46.66 LED6.C 22.84,46.12 v22.11,45.38
  Bottom 0.152: v16.61,41.86 16.61,41.89 17.48,41.89 20.98,45.39 v22.11,45.38
N$14  (via drill 0.5)
  other vias: 28.8,28.18
N$15
  Top 0.152: LED1.1 27.43,63.4 28.18,62.65 28.18,60.95 27.55,60.32 25.64,60.32 24.54,59.21 24.54,53 23.6,52.06 | R1.5 20.27,41.79 20.27,48.73 23.6,52.06 | 23.6,52.06 23.61,52.06
N$16  (via drill 0.5)
  other vias: 28.88,30.42
N$17  (via drill 0.5)
  other vias: 24.86,30.44
N$18  (via drill 0.5)
  other vias: 24.82,32.52
N$19  (via drill 0.5)
  other vias: 24.83,34.58
N$20  (via drill 0.5)
  other vias: 24.81,36.65
N$21  (via drill 0.5)
  other vias: 24.8,38.84
N$22  (via drill 0.5)
  other vias: 24.82,40.97
N$23  (via drill 0.5)
  other vias: 24.78,43.11
N$24  (via drill 0.5)
  other vias: 24.81,45.23
N$26  (via drill 0.5)
  other vias: 25.9,28.16
N$27  (via drill 0.5)
  other vias: 28.84,32.5
N$28  (via drill 0.5)
  other vias: 28.85,34.57
N$29  (via drill 0.5)
  other vias: 28.83,36.65
N$30  (via drill 0.5)
  other vias: 28.8,38.83
N$31  (via drill 0.5)
  other vias: 28.81,40.96
N$32  (via drill 0.5)
  other vias: 28.78,43.11
N$33  (via drill 0.5)
  other vias: 28.83,45.23
N$35
  Top 1: 25.93,28.14 25.91,28.14
OUTA  (via drill 0.3)
  Top 0.152: U1.14 19.51,32.77 19.96,32.77 21.18,33.98 21.18,36.76 20.88,37.05 v20.88,37.19 | v12.1,59.8 12.24,59.8 LED3.A | v22.17,60.65 20.01,60.65 19.67,60.31 X3.3
  Bottom 0.152: 26.36,55.78 26.36,58.37 26.01,58.73 25.06,58.73 23.19,60.6 22.23,60.6 v22.17,60.65 | v20.88,37.19 20.88,38.68 22.4,40.2 22.4,40.22 23.02,40.84 23.02,42.17 23.39,42.53 23.39,43.33 23.05,43.66 23.02,51.03 23.5,51.5 25.81,51.5 26.36,52.05 26.36,55.78 | v12.1,59.8 12.11,58.89 13.17,57.83 18.55,57.83 X3.3 19.67,58.91 | 26.36,55.78
OUTB  (via drill 0.3)
  Top 0.152: LED4.A 15.31,60.91 v14.3,59.9 | U1.11 19.97,31.25 20.25,30.97 21.13,30.45 22.34,30.45 22.83,30.95 22.83,34.61 22.82,34.62 22.82,34.71 23.27,35.16 23.27,35.77 23,36.05 23.01,36.07 23.01,41.5 22.33,42.18 21.88,42.18 21.88,43.13 v21.52,43.49 | v22,56.7 21.98,56.7 21.09,57.59 21.09,58.87 X3.2
  Bottom 0.152: X3.2 21.15,60.55 20.3,61.4 16.8,61.4 16.01,60.61 16.01,59.91 16,59.9 v14.3,59.9 | 20.84,49.05 20.98,49.2 | 20.98,49.2 22,50.22 v22,56.7 | 20.98,49.2 22.31,47.87 22.35,47.87 22.71,47.51 22.71,43.71 22.5,43.49 v21.52,43.49
PUSH  (via drill 0.3)  (1 unrouted)
  Top 0.152: v14.78,28.04 14.48,28.35 15.09,28.96 15.09,29.42 U1.1 | SPK1.+ 20.7,50.87 23.14,53.31 23.14,54.01 v23.18,54.05 | 25.71,52.48 v25.53,52.66 24.68,52.66 20.65,48.63 20.65,41.84 20.78,41.71 22.17,41.71 22.69,41.19 22.69,39.07 22.4,38.78 v22.36,38.92
  Bottom 0.152: v14.78,28.04 14.78,29.87 19.73,34.79 19.95,34.98 20.59,34.98 21.57,35.97 21.57,38.06 v22.36,38.92 | v22.36,38.92 22.37,38.94 | v23.18,54.05 25.2,54.05 25.79,53.46 25.79,53.19 25.53,52.93 v25.53,52.66 | 22.39,38.87 v22.36,38.92
RIRQ  (via drill 0.3)
  Top 0.152: v14.17,21.95 14.17,30.03 14.33,30.18 U1.32 | v14.16,10.39 14.17,6.86 15.54,5.49 15.54,4.73 15.7,4.57 U$1.IRQ
  Bottom 0.152: v14.16,10.39 v14.17,21.95
RSCK
  Top 0.152: U1.2 15.54,29.42 15.54,28.96 15.24,28.65 15.24,28.5 15.39,28.35 15.39,27.66 14.54,26.81 14.54,22.61 14.82,22.33 14.82,21.73 15.39,21.16 15.39,20.88 15.7,20.58 U$1.SCK
RSDI  (via drill 0.3)
  Top 0.152: v18.14,21.64 17.98,21.49 17.98,20.73 17.83,20.58 U$1.SDI | U1.9 19.51,30.18 19.51,30.03 19.66,29.87 19.66,29.42 19.89,29.19 v20.59,29.19
  Bottom 0.152: v18.14,21.64 19.62,21.64 20.27,22.29 20.27,28.87 v20.59,29.19
RSDO  (via drill 0.3)
  Top 0.152: v20.42,30.18 19.87,30.71 19.42,30.71 U1.10 | v13.44,9.5 13.41,4.88 13.72,4.57 U$1.SDO
  Bottom 0.152: v20.42,30.18 20.42,29.87 13.41,22.86 v13.44,9.5
RSEL
  Top 0.152: 13.56,20.73 13.72,20.58 U$1.SEL 13.74,21.16 13.5,21.4 13.5,24.9 13.25,25.16 12.88,25.16 12.32,25.72 12.32,26.55 11.97,26.91 11.97,29.01 11.71,29.26 11.43,29.26 11.42,29.25 10.89,29.25 9.84,30.3 9.84,32.5 10.19,32.85 11.57,32.85 11.82,33.1 13.4,33.1 13.5,33.2 14.32,33.2 U1.26 14.13,33.18
RST  (via drill 0.3)
  Top 0.152: R7.2 11.43,39.93 10.82,39.93 v10.46,39.78 10.79,40.1 10.79,41.77 11.07,42.05 11.08,42.05 11.94,42.9 12.6,42.9 v13.1,43.4 | U1.29 13.15,31.75 12.3,30.9 12.3,27.2 12.7,26.8 12.7,26.6 v13,26.3 | v15.21,8.74 15.34,8.62 v15.34,6.79 | U$2.P$1 25.76,58.58 v25.76,58.07
  Bottom 0.152: v10.46,39.78 16.46,39.78 18.44,37.8 18.44,37.23 17.23,36.13 17.22,35.34 18.45,34.11 18.44,33.99 13.56,29.11 13.56,26.3 | 13.56,26.3 13.56,24.54 13.36,24.54 9.94,21.13 9.94,19.76 9.64,19.46 8.79,19.46 6.96,17.62 6.96,16.75 6.28,16.07 5.1,16.07 4.88,15.85 4.88,10.12 6.75,8.25 11.77,8.25 12.26,8.74 v15.21,8.74 | JP1.4 20.42,1.98 15.85,6.56 15.57,6.56 v15.34,6.79 | v13,26.3 13.56,26.3 | v13.1,43.4 13.1,45.1 12.58,45.62 12.58,52.49 12.59,52.49 12.59,54.9 13.11,55.43 13.11,56.75 13.82,57.46 18.04,57.46 18.89,56.61 19.87,56.61 20.21,56.95 20.56,56.95 21.11,57.5 21.11,57.87 21.29,58.05 25.74,58.05 v25.76,58.07
RXD  (via drill 0.3)
  Top 0.152: v12.95,27.59 12.8,27.74 12.8,30.63 13.41,31.24 14.33,31.24 U1.30 | v17.83,37.54 17.83,38.41 19.09,39.67 R1.3
  Bottom 0.152: 5.18,19.81 v12.95,27.59 12.95,28.96 17.83,33.84 17.83,34.07 16.85,35.05 16.85,36.28 17.83,37.31 v17.83,37.54
SCK  (via drill 0.3)
  Top 0.152: U1.17 18.59,34.6 18.59,35.21 19.17,35.79 19.17,35.94 19.03,36.09 19.03,36.51 19.14,36.62 19.14,37.73 19.2,37.8 19.21,38.24 19.74,38.73 20.8,38.73 21.79,37.89 v21.79,32.77 | v20.73,5.49 20.73,3.81 20.42,3.51 19.66,3.51 18.14,1.98 JP1.3
  Bottom 0.152: v20.73,5.49 20.73,28.35 21.79,29.42 v21.79,32.77
SCL  (via drill 0.3)
  Top 0.152: v11.58,37 11.58,38.1 R7.4 11.54,38.17 v10.32,38.16 9.89,37.73 X2.P$8 | U1.28 14.3,32.27 12.98,32.27 12.3,31.6 12.13,31.6 v11.73,31.2 | U2.1 7.61,27.05 v7.97,26.66 | v6.71,24.23 6.71,22.21 6.08,21.59 6.08,20.72 5.54,20.18 5.54,19.61 5.98,19.16 5.98,17.84 5.56,17.42 5.56,16.98 6.3,16.24 6.3,14.03 v5.74,13.47 6.01,13.75 | 6.89,60.9 IC1.SCL arc-90 6.85,60.83 4.95,60.83 v4.33,61.44 | v8.72,38.29 8.48,38.29 v6.74,40.08 | IC3.2 14.29,51.15 11.4,51.15 8.91,53.64 5.11,53.64 arc90 4.65,53.18 v4.65,53.1
  Bottom 0.152: 8.4,26.23 6.71,24.54 v6.71,24.23 | 8.4,26.23 10.2,28.03 10.2,30.63 10.77,31.2 v11.73,31.2 12.4,31.2 13.72,32.52 13.72,34.18 12.36,35.54 12.36,36.57 v11.58,37 | CN1.2 5.98,12.25 5.74,12.49 v5.74,13.47 | v7.97,26.66 v7.97,26.65 8.4,26.23 | v10.32,38.16 8.74,38.17 v8.72,38.29 | 6.13,52.86 6.13,57.82 5.92,58.03 4.98,58.03 4.25,58.76 4.25,61.36 v4.33,61.44 | 6.13,52.86 6.13,47.82 6.14,47.81 6.14,42.74 6.14,42.73 6.14,40.69 6.76,40.08 6.89,40.08 6.77,40.09 v6.74,40.08 | v4.65,53.1 arc90 4.89,52.86 6.13,52.86
SDA  (via drill 0.3)
  Top 0.152: R7.3 11.43,39.02 11.12,39.02 11.03,39.05 10.72,39.05 10.65,39.05 10.27,39.05 | U1.27 14.33,32.77 12.27,32.77 v11.8,32.3 | U2.6 7.62,29.41 v7.29,29.74 | IC1.SDA v5.35,60.24 v5.35,60.23 | v7.79,40.01 9.29,40.04 10.27,39.06 10.27,39.05 | 10.27,39.05 10.15,39.17 9.37,38.39 9.37,38.07 8.69,37.38 8.22,37.38 | 8.22,37.38 7.77,37.38 7.47,37.08 7.47,34.6 6.63,33.76 6.63,32.77 v6.62,32.75 6.62,32.83 | X2.P$1 8.22,36.68 8.22,37.38 | v5.68,11.09 5.57,11.21 v3.06,11.21 | IC3.1 11.37,51.64 9.44,53.58 9.44,54.33 v9.46,54.35
  Bottom 0.152: v11.8,32.3 11.1,31.6 7.6,31.6 7.3,31.9 | CN1.1 5.98,9.71 5.86,9.82 5.86,10.68 5.68,10.87 v5.68,11.09 | v7.29,29.74 7.29,31.89 7.3,31.9 | v5.35,60.23 5.09,59.97 5.09,59.23 5.73,58.59 7.22,58.59 7.5,58.31 7.5,55.04 | 7.5,55.04 7.5,51.05 7.5,51.04 7.5,40.29 v7.79,40.01 7.79,39.88 7.06,39.15 4.79,39.15 4.46,39.49 2.43,39.49 2.16,39.23 2.16,29.42 3.18,28.4 3.18,20.92 3.77,20.33 3.77,17.51 2.91,16.65 2.91,11.36 v3.06,11.21 | v6.62,32.75 7.3,32.07 7.3,31.9 | v9.46,54.35 9.46,54.39 8.91,54.94 7.6,54.94 7.5,55.04
TXD  (via drill 0.3)
  Top 0.152: v13.41,30.33 13.78,30.71 14.39,30.71 U1.31 | v14.17,37.95 14.63,38.41 15.9,38.41 16.76,39.27 17.98,39.27 18.29,39.58 R1.2
  Bottom 0.152: 5.18,22.25 5.79,22.86 6.25,22.86 7.7,22.9 12.2,27.4 12.2,27.8 12.6,28.2 12.6,29.21 13.41,30.03 v13.41,30.33 14.17,31.09 14.18,34.36 13.87,34.66 13.87,35.81 13.53,36.15 13.53,36.73 14.18,37.38 v14.18,37.95 v14.17,37.95
USB_D+  (via drill 0.3)
  Top 0.152: R2.1 11.12,23.36 | 11.12,23.36 D2.C 10.3,24.17 | v6.52,19.94 6.95,19.94 6.99,19.9 6.99,5.74 6.73,5.48 5.62,5.48 5.31,5.16 J3.D+ | v9.62,22.13 10.67,22.14 10.89,22.37 10.89,23.13 11.12,23.36
  Bottom 0.152: v6.52,19.94 8.71,22.14 v9.62,22.13
USB_D-  (via drill 0.3)
  Top 0.152: v6.28,17.21 6.66,16.83 6.66,6.03 6.46,5.82 5.09,5.82 4.66,5.39 J3.D- | D1.C 8.27,23.47 8.27,20.64 8.56,20.34 v8.95,20.34 8.97,20.33 8.97,19.79 9.15,19.61 12.66,19.61 12.91,19.36 16.47,19.36 16.75,19.63 16.75,21.94 R5.1 arc90 17.45,22.69 R3.1
  Bottom 0.152: v6.28,17.21 6.28,17.69 8.64,20.05 8.66,20.05 v8.95,20.34
XTAL1
  Top 0.152: C8.1 17.06,26.22 Y2.P$2
XTAL2
  Top 0.152: C10.1 19.56,26.4 Y2.P$1
(copper drawn outside any net)
  shapes: Top area x1

### Text on the board
tPlace: On | OutA | OutB | RST | Act | Radio | Tx | Rx | DotShine v1.0.0 | 08.2018 | GND | SDA | GND | MOSI
bPlace: Mihai Galos | LoRA | FSK
tNames: remember to connect the UV sensor